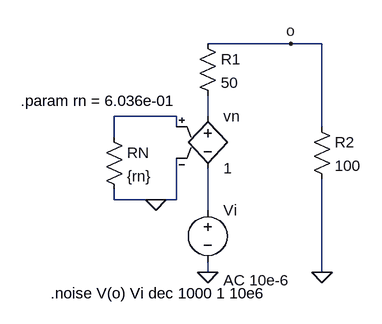
[diagram p0: schematic ejemplo2.asc]
ejemplo2.asc, the LTspice schematic file:
Version 4
SHEET 1 880 680
WIRE 256 16 128 16
WIRE 304 16 256 16
WIRE 80 128 -16 128
WIRE 128 128 128 96
WIRE 80 144 80 128
WIRE 304 144 304 16
WIRE -16 160 -16 128
WIRE -16 256 -16 240
WIRE 48 256 -16 256
WIRE 80 256 80 192
WIRE 80 256 48 256
WIRE 128 272 128 208
WIRE 128 368 128 352
WIRE 304 368 304 224
FLAG 128 368 0
FLAG 304 368 0
FLAG 48 256 0
FLAG 256 16 o
SYMBOL res -32 144 R0
SYMATTR InstName RN
SYMATTR Value {rn}
SYMBOL e 128 112 R0
SYMATTR InstName vn
SYMATTR Value 1
SYMBOL res 112 0 R0
SYMATTR InstName R1
SYMATTR Value 50
SYMBOL res 288 128 R0
SYMATTR InstName R2
SYMATTR Value 100
SYMBOL voltage 128 256 R0
WINDOW 123 24 124 Left 2
WINDOW 39 0 0 Left 0
SYMATTR InstName Vi
SYMATTR Value ""
SYMATTR Value2 AC 10e-6
TEXT -160 104 Left 2 !.param rn = 6.036e-01
TEXT -114 400 Left 2 !.noise V(o) Vi dec 1000 1 10e6

The netlist it stands for:
* ejemplo2.asc
RN N001 0 {rn}
E§vn N002 N003 N001 0 1
R1 o N002 50
R2 o 0 100
Vi N003 0 AC 10e-6
.param rn = 6.036e-01
.noise V(o) Vi dec 1000 1 10e6
.backanno
.end